# EAGLE schematic Schematic (EAGLE 9.6.2)
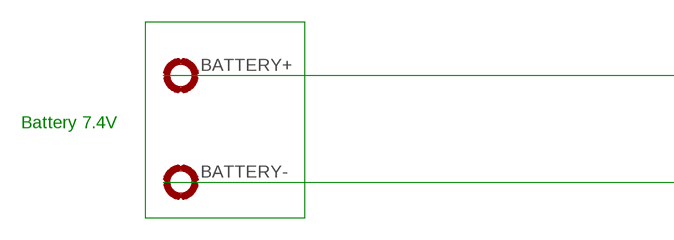
[diagram p0: schematic, sheet 1, part 1 of 2]
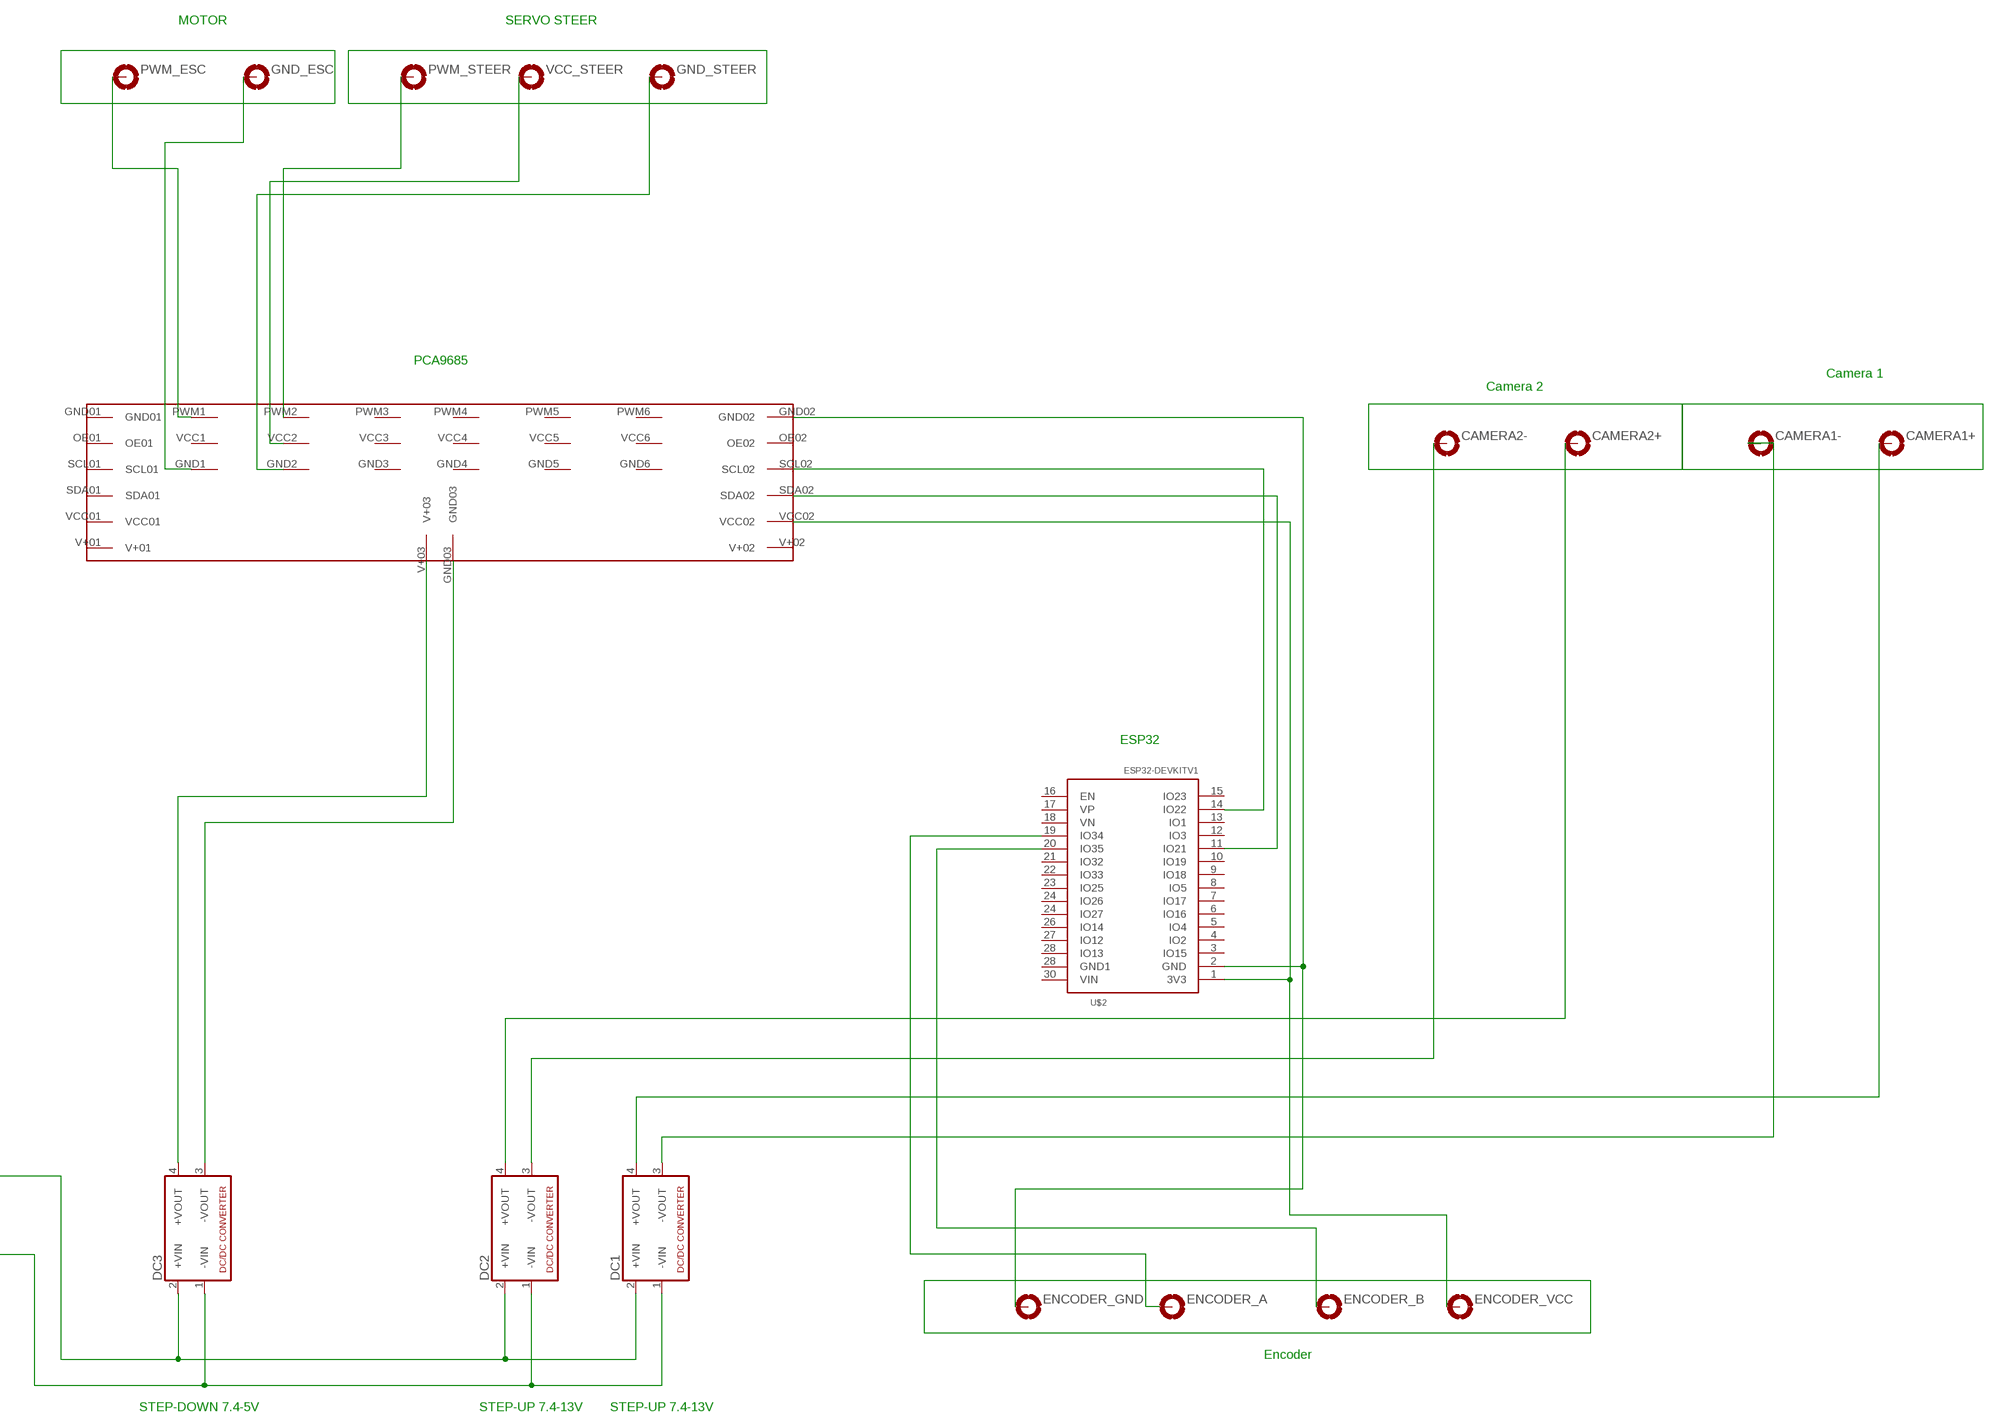
[diagram p1: schematic, sheet 1, part 2 of 2]

## Parts
BATTERY+  MOUNT-PAD-ROUND2.8  [2,8-PAD]
BATTERY-  MOUNT-PAD-ROUND2.8  [2,8-PAD]
CAMERA1+  MOUNT-PAD-ROUND2.8  [2,8-PAD]
CAMERA1-  MOUNT-PAD-ROUND2.8  [2,8-PAD]
CAMERA2+  MOUNT-PAD-ROUND2.8  [2,8-PAD]
CAMERA2-  MOUNT-PAD-ROUND2.8  [2,8-PAD]
DC1  NME  [NME]
DC2  NME  [NME]
DC3  NME  [NME]
ENCODER_A  MOUNT-PAD-ROUND2.8  [2,8-PAD]
ENCODER_B  MOUNT-PAD-ROUND2.8  [2,8-PAD]
ENCODER_GND  MOUNT-PAD-ROUND2.8  [2,8-PAD]
ENCODER_VCC  MOUNT-PAD-ROUND2.8  [2,8-PAD]
GND_ESC  MOUNT-PAD-ROUND2.8  [2,8-PAD]
GND_STEER  MOUNT-PAD-ROUND2.8  [2,8-PAD]
PWM_ESC  MOUNT-PAD-ROUND2.8  [2,8-PAD]
PWM_STEER  MOUNT-PAD-ROUND2.8  [2,8-PAD]
U$1  PCA9685PCA9685  [DIP5918W53P254L2279H300Q12B]
U$2  ESP32DEVKITV1  [ESP32-DEVKITV1]
VCC_STEER  MOUNT-PAD-ROUND2.8  [2,8-PAD]

## Nets
N$1: ENCODER_GND.B2,8(MOUNT) U$1.GND02 U$2.2(GND)
N$2: ENCODER_VCC.B2,8(MOUNT) U$1.VCC02 U$2.1(3V3)
N$3: U$1.SCL02 U$2.14(IO22)
N$4: U$1.SDA02 U$2.11(IO21)
N$5: BATTERY-.B2,8(MOUNT) DC1.1(-VIN) DC2.1(-VIN) DC3.1(-VIN)
N$6: BATTERY+.B2,8(MOUNT) DC1.2(+VIN) DC2.2(+VIN) DC3.2(+VIN)
N$7: CAMERA1-.B2,8(MOUNT) DC1.3(-VOUT)
N$8: CAMERA1+.B2,8(MOUNT) DC1.4(+VOUT)
N$9: CAMERA2+.B2,8(MOUNT) DC2.4(+VOUT)
N$10: CAMERA2-.B2,8(MOUNT) DC2.3(-VOUT)
N$11: DC3.3(-VOUT) U$1.GND03
N$12: DC3.4(+VOUT) U$1.V+03
N$15: ENCODER_A.B2,8(MOUNT) U$2.19(IO34)
N$16: ENCODER_B.B2,8(MOUNT) U$2.20(IO35)
N$18: PWM_ESC.B2,8(MOUNT) U$1.PWM1(PWM$1)
N$19: GND_ESC.B2,8(MOUNT) U$1.GND1(GND$1)
N$22: PWM_STEER.B2,8(MOUNT) U$1.PWM2(PWM$2)
N$23: U$1.VCC2(VCC$2) VCC_STEER.B2,8(MOUNT)
N$24: GND_STEER.B2,8(MOUNT) U$1.GND2(GND$2)
Unconnected: U$1.GND01 U$1.GND3(GND$3) U$1.GND4(GND$4) U$1.GND5(GND$5) U$1.GND6(GND$6) U$1.OE01 U$1.OE02 U$1.PWM3(PWM$3) U$1.PWM4(PWM$4) U$1.PWM5(PWM$5) U$1.PWM6(PWM$6) U$1.SCL01 U$1.SDA01 U$1.V+01 U$1.V+02 U$1.VCC01 U$1.VCC1(VCC$1) U$1.VCC3(VCC$3) U$1.VCC4(VCC$4) U$1.VCC5(VCC$5) U$1.VCC6(VCC$6) U$2.3(IO15) U$2.4(IO2) U$2.5(IO4) U$2.6(IO16) U$2.7(IO17) U$2.8(IO5) U$2.9(IO18) U$2.10(IO19) U$2.12(IO3) U$2.13(IO1) U$2.15(IO23) U$2.16(EN) U$2.17(VP) U$2.18(VN) U$2.21(IO32) U$2.22(IO33) U$2.23(IO25) U$2.24(IO26) U$2.24(IO27) U$2.26(IO14) U$2.27(IO12) U$2.28(GND1) U$2.28(IO13) U$2.30(VIN)

## Notes on the sheet
- MOTOR | SERVO STEER
- PCA9685
- Camera 1
- Camera 2
- ESP32
- Battery 7.4V
- Encoder
- STEP-DOWN 7.4-5V | STEP-UP 7.4-13V | STEP-UP 7.4-13V

## Library data of the parts
BATTERY+ BATTERY- CAMERA1+ CAMERA1- CAMERA2+ CAMERA2- ENCODER_A ENCODER_B ENCODER_GND ENCODER_VCC GND_ESC GND_STEER PWM_ESC PWM_STEER VCC_STEER = holes:MOUNT-PAD-ROUND: MOUNTING PAD, round
DC1-DC3 = dc-dc-converter:NME: DC-DC CONVERTER; MF: C & D TECHNOLOGIES, INC; MPN: NME1205D; OC_FARNELL: 1021466; OC_NEWARK: 98B8198
U$1 = Library:PCA9685
U$2 = ESP32-DEVKITV1:ESP32DEVKITV1